# EAGLE design Robot Controller (EAGLE 6.4)
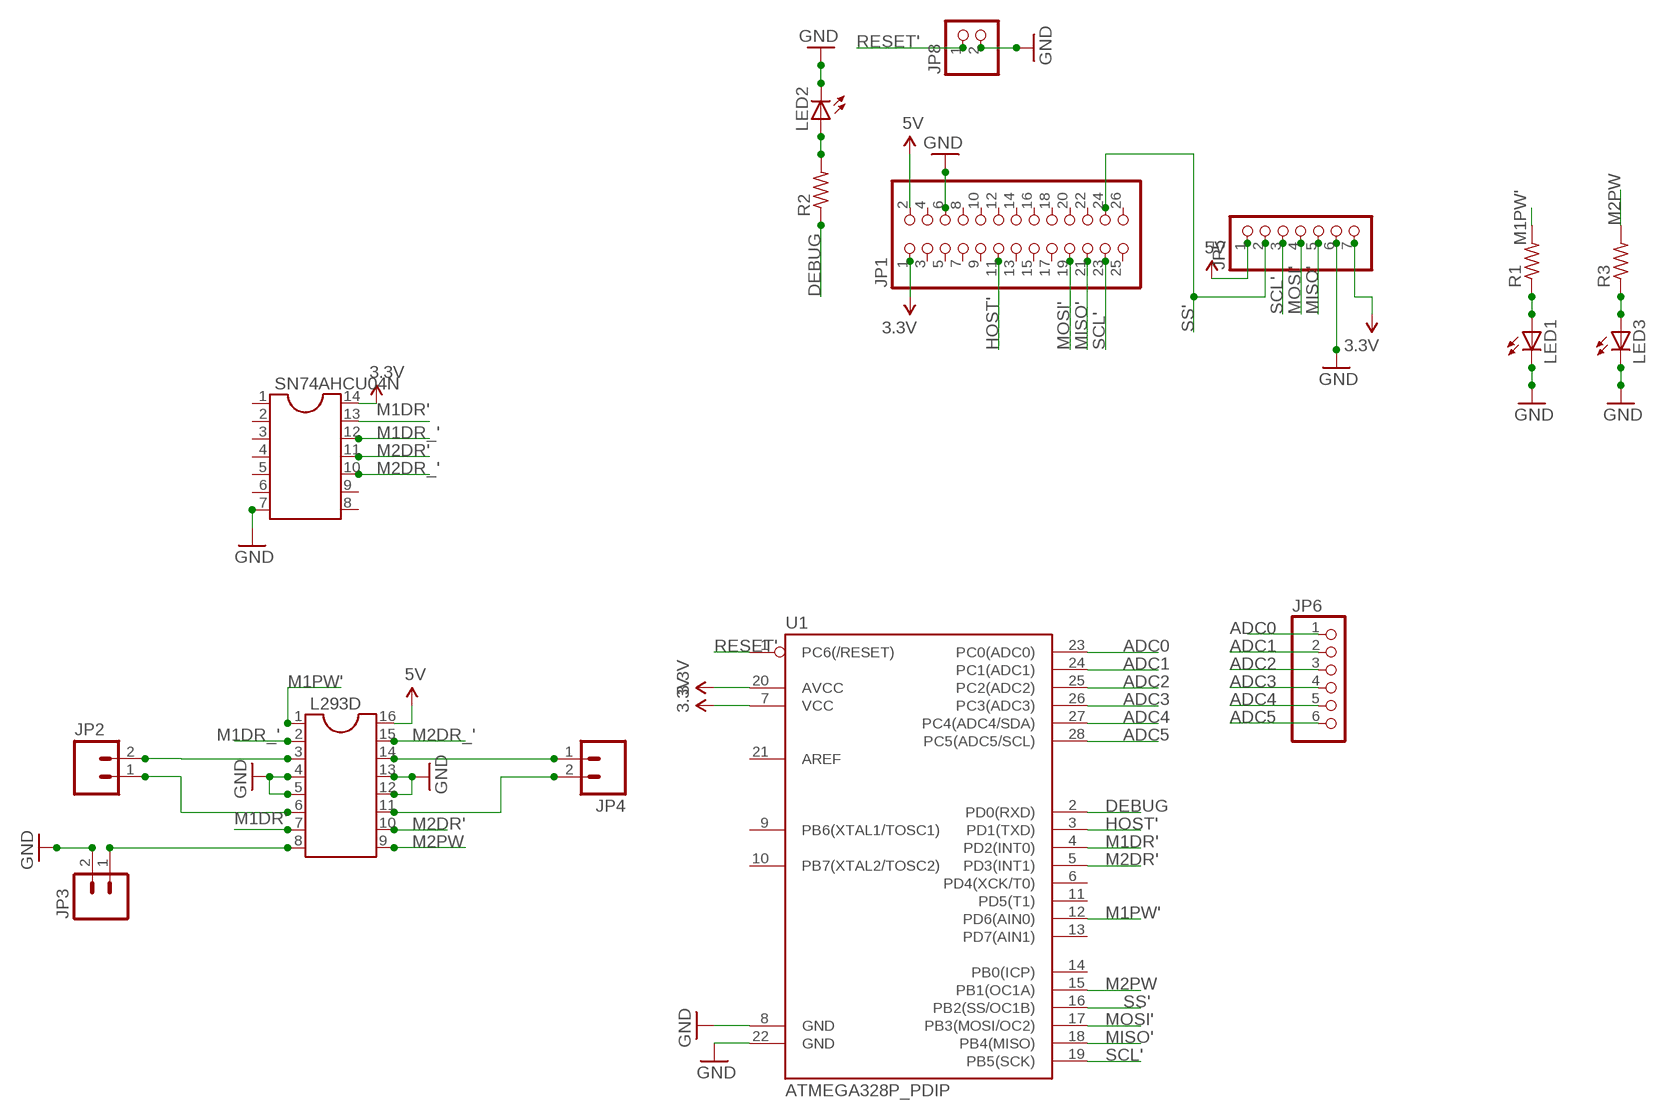
[diagram p0: schematic, sheet 1]

## Parts
JP1  PINHD-2X13  [2X13]
JP2  M025MM  [SCREWTERMINAL-5MM-2]
JP3  M025MM  [SCREWTERMINAL-5MM-2]
JP4  M025MM  [SCREWTERMINAL-5MM-2]
JP5  PINHD-1X7  [1X07]
JP6  PINHD-1X6  [1X06]
JP8  PINHD-1X2  [1X02]
L293D  DIL16S  [SOCKET-16]
LED1  LEDSMT1206  [1206]
LED2  LEDSMT1206  [1206]
LED3  LEDSMT1206  [1206]
R1  R-US_R3216  [R3216]
R2  R-US_R3216  [R3216]
R3  R-US_R3216  [R3216]
SN74AHCU04N  DIL14S  [SOCKET-14]
U1  ATMEGA328P_PDIP  [DIL28-3]

## Nets
3.3V: JP1.1 JP5.7 SN74AHCU04N.14 U1.7(VCC) U1.20(AVCC)
5V: JP1.2 JP5.1 L293D.16
ADC0: JP6.1 U1.23(PC0(ADC0))
ADC1: JP6.2 U1.24(PC1(ADC1))
ADC2: JP6.3 U1.25(PC2(ADC2))
ADC3: JP6.4 U1.26(PC3(ADC3))
ADC4: JP6.5 U1.27(PC4(ADC4/SDA))
ADC5: JP6.6 U1.28(PC5(ADC5/SCL))
DEBUG: R2.1 U1.2(PD0(RXD))
GND: JP1.6 JP3.2 JP5.6 JP8.2 L293D.4 L293D.5 L293D.12 L293D.13 LED1.C LED2.C LED3.C SN74AHCU04N.7 U1.8(GND) U1.22(GND)
HOST': JP1.11 U1.3(PD1(TXD))
M1DR': L293D.7 SN74AHCU04N.13 U1.4(PD2(INT0))
M1DR_': L293D.2 SN74AHCU04N.12
M1PW': L293D.1 R1.2 U1.12(PD6(AIN0))
M2DR': L293D.10 SN74AHCU04N.11 U1.5(PD3(INT1))
M2DR_': L293D.15 SN74AHCU04N.10
M2PW: L293D.9 R3.2 U1.15(PB1(OC1A))
MISO': JP1.21 JP5.5 U1.18(PB4(MISO))
MOSI': JP1.19 JP5.4 U1.17(PB3(MOSI/OC2))
N$3: LED1.A R1.1
N$8: JP2.2 L293D.3
N$9: JP2.1 L293D.6
N$10: JP3.1 L293D.8
N$14: LED3.A R3.1
N$17: LED2.A R2.2
N$18: JP4.1 L293D.14
N$19: JP4.2 L293D.11
RESET': JP8.1 U1.1(PC6(/RESET))
SCL': JP1.23 JP5.3 U1.19(PB5(SCK))
SS': JP1.24 JP5.2 U1.16(PB2(SS/OC1B))
Unconnected: JP1.3 JP1.4 JP1.5 JP1.7 JP1.8 JP1.9 JP1.10 JP1.12 JP1.13 JP1.14 JP1.15 JP1.16 JP1.17 JP1.18 JP1.20 JP1.22 JP1.25 JP1.26 SN74AHCU04N.1 SN74AHCU04N.2 SN74AHCU04N.3 SN74AHCU04N.4 SN74AHCU04N.5 SN74AHCU04N.6 SN74AHCU04N.8 SN74AHCU04N.9 U1.6(PD4(XCK/T0)) U1.9(PB6(XTAL1/TOSC1)) U1.10(PB7(XTAL2/TOSC2)) U1.11(PD5(T1)) U1.13(PD7(AIN1)) U1.14(PB0(ICP)) U1.21(AREF)

## Notes on the sheet
- RESET'
- M1PW'
- M2PW
- DEBUG
- SCL' | MOSI' | MISO'
- SS'
- HOST' | MOSI' | MISO' | SCL'
- M1DR'
- M1DR_'
- M2DR'
- M2DR_'
- ADC0
- RESET' | ADC0 | ADC1
- ADC1 | ADC2
- M1PW' | ADC2 | ADC3
- ADC3 | ADC4
- ADC4 | ADC5
- M1DR_' | M2DR_' | ADC5
- M1DR' | DEBUG
- M2DR' | HOST'
- M2PW | M1DR'
- M2DR'
- M1PW'
- M2PW
- SS'
- MOSI'
- MISO'
- SCL'

## Library data of the parts
JP1 = pinhead:PINHD-2X13: PIN HEADER
JP2-JP4 = SparkFun-Connectors:M02: Header 2 Standard 2-pin 0.1" header. Use with straight break away headers (SKU : PRT-00116), right angle break away headers (PRT-00553), swiss pins (PRT-00743), machine pins (PRT-00117), and female headers (PRT-00115). Molex polarized connector foot print use with SKU : PRT-08233 with associated crimp pins and housings.
JP5 = pinhead:PINHD-1X7: PIN HEADER
JP6 = pinhead:PINHD-1X6: PIN HEADER
JP8 = pinhead:PINHD-1X2: PIN HEADER
L293D = ic-package:DIL16: Dual In Line / Socket
LED1-LED3 = led:LED: LED OSRAM: - CHIPLED LG R971, LG N971, LY N971, LG Q971, LY Q971, LO R971, LY R971 LH N974, LH R974 LS Q976, LO Q976, LY Q976 LO Q996 - Hyper CHIPLED LW Q18S LB Q993, LB Q99A, LB R99A - SideLED LS A670, LO A670, LY A670, LG A670, LP A670 LB A673, LV A673, LT A673, LW A673 LH A674 LY A675 LS A676, LA A676, LO A676, LY A676, LW A676 LS A679, LY A679, LG A679 - Hyper Micro SIDELED® LS Y876, LA Y876, LO Y876, LY Y876 LT Y87S - SmartLED LW L88C, LW L88S LB L89C, LB L89S, LG L890 LS L89K, LO L89K, LY L89K LS L896, LA L896, LO L896, LY L896 - TOPLED LS T670, LO T670, LY T670, LG T670, LP T670 LSG T670, LSP T670, LSY T670, LOP T670, LYG T670 LG T671, LOG T671, LSG T671 LB T673, LV T673, LT T673, LW T673 LH T674 LS T676, LA T676, LO T676, LY T676, LB T676, LH T676, LSB T676, LW T676 LB T67C, LV T67C, LT T67C, LS T67K, LO T67K, LY T67K, LW E67C LS E67B, LA E67B, LO E67B, LY E67B, LB E67C, LV E67C, LT E67C LW T67C LS T679, LY T679, LG T679 LS T770, LO T770, LY T770, LG T770, LP T770 LB T773, LV T773, LT T773, LW T773 LH T774 LS E675, LA E675, LY E675, LS T675 LS T776, LA T776, LO T776, LY T776, LB T776 LHGB T686 LT T68C, LB T68C - Hyper Mini TOPLED® LB M676 - Mini TOPLED Santana® LG M470 LS M47K, LO M47K, LY M47K Source: http://www.osram.convergy.de LUXEON: - LUMILED® LXK2-PW12-R00, LXK2-PW12-S00, LXK2-PW14-U00, LXK2-PW14-V00 LXK2-PM12-R00, LXK2-PM12-S00, LXK2-PM14-U00 LXK2-PE12-Q00, LXK2-PE12-R00, LXK2-PE12-S00, LXK2-PE14-T00, LXK2-PE14-U00 LXK2-PB12-K00, LXK2-PB12-L00, LXK2-PB12-M00, LXK2-PB14-N00, LXK2-PB14-P00, LXK2-PB14-Q00 LXK2-PR12-L00, LXK2-PR12-M00, LXK2-PR14-Q00, LXK2-PR14-R00 LXK2-PD12-Q00, LXK2-PD12-R00, LXK2-PD12-S00 LXK2-PH12-R00, LXK2-PH12-S00 LXK2-PL12-P00, LXK2-PL12-Q00, LXK2-PL12-R00 Source: www.luxeon.com KINGBRIGHT: KA-3528ASYC Source: www.kingbright.com
R1-R3 = resistor:R-US_: RESISTOR, American symbol
SN74AHCU04N = ic-package:DIL14: Dual In Line / Socket
U1 = SparkFun-DigitalIC:ATMEGA328P_PDIP: uC used in the Arduino 32kb flash, 1k EEPROM, 2k SRAM This is the through-hole version of this chip.

## Board
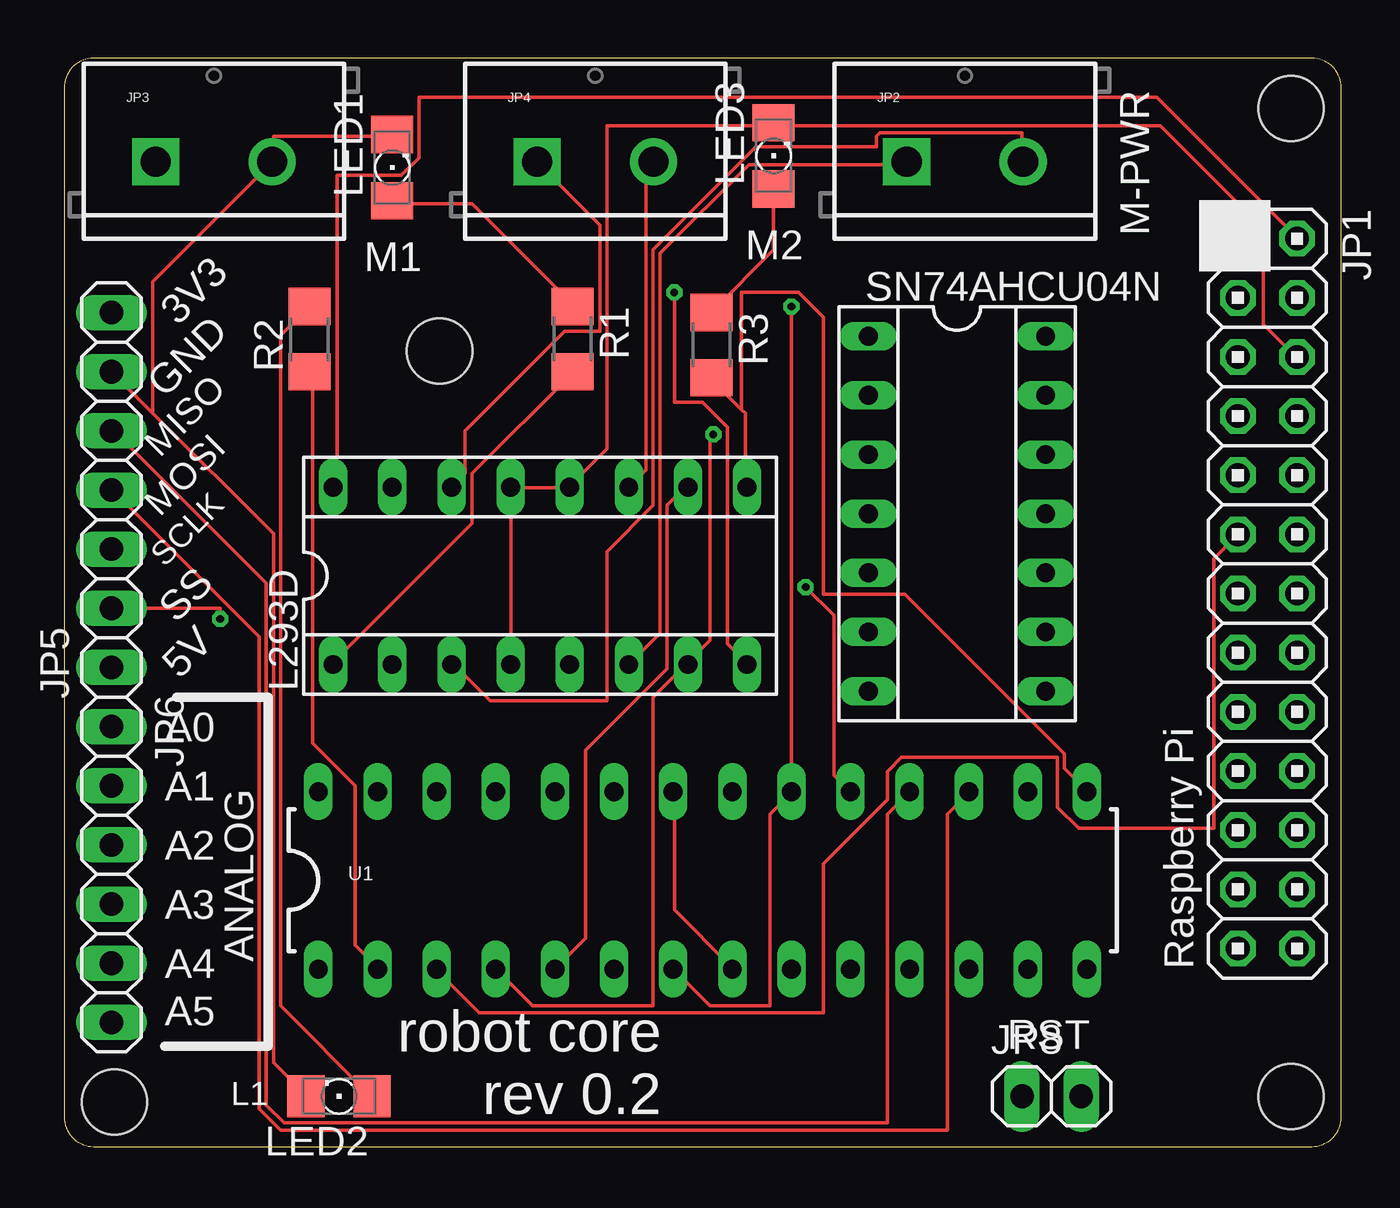
[diagram p1: board, top side]
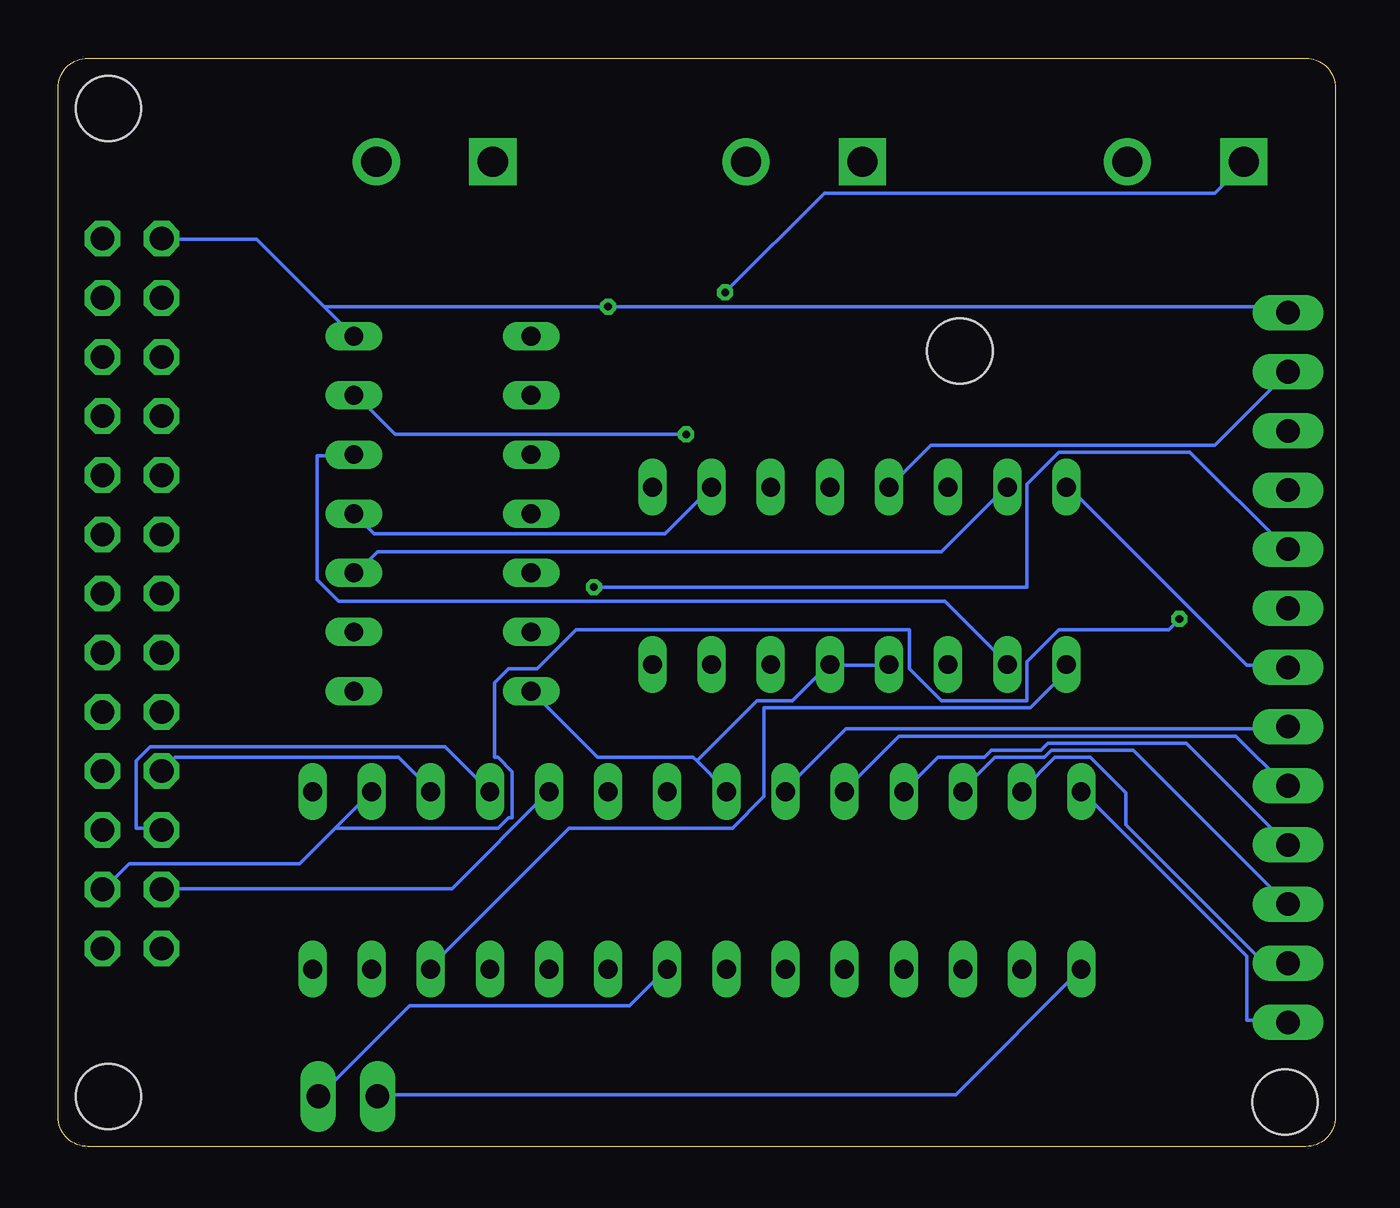
[diagram p2: board, bottom side, seen from below]

Size 54.86 x 46.74 mm. Coordinates in mm from the lower left corner, seen from the top.
Outline: 0,45.47 0,1.27 arc90 1.27,0 53.59,0 arc90 54.86,1.27 54.86,45.47 arc90 53.59,46.74 1.27,46.74 arc90 0,45.47
Copper layers (1*16): Top 0.0356mm / dielectric 1.5011mm / Bottom 0.0356mm
Design rules "OSHPark": minimum track width 6mil, minimum drill 13mil, track to track 6mil, track to pad 6mil, pad to pad 6mil, via to via 6mil, smd to smd 6mil, copper to edge 15mil, drill to drill 6mil, minimum pad ring 7mil, minimum via ring 7mil, stop-mask expansion 4mil, vias tented up to drill 0mil, thermal gap 10mil
Holes 2.8 mm at 52.71,2.16 52.71,44.58 16.13,34.16 2.16,1.91

### Footprints (pad centres in the part's own frame; a part is rotated, then mirrored left to right if it is on the bottom)
2X13 = drill 1.016 octagon: 1 -15.24,-1.27; 2 -15.24,1.27; 3 -12.7,-1.27; 4 -12.7,1.27; 5 -10.16,-1.27; 6 -10.16,1.27; 7 -7.62,-1.27; 8 -7.62,1.27; 9 -5.08,-1.27; 10 -5.08,1.27; 11 -2.54,-1.27; 12 -2.54,1.27; 13 0,-1.27; 14 0,1.27; 15 2.54,-1.27; 16 2.54,1.27; 17 5.08,-1.27; 18 5.08,1.27; 19 7.62,-1.27; 20 7.62,1.27; 21 10.16,-1.27; 22 10.16,1.27; 23 12.7,-1.27; 24 12.7,1.27; 25 15.24,-1.27; 26 15.24,1.27
SCREWTERMINAL-5MM-2 = drill 1.3 pad 2.032 square: 1 0,0 | drill 1.3 pad 2.032: 2 5,0
1X07 = drill 1.016 long: 1 -7.62,0; 2 -5.08,0; 3 -2.54,0; 4 0,0; 5 2.54,0; 6 5.08,0; 7 7.62,0
1X06 = drill 1.016 long: 1 -6.35,0; 2 -3.81,0; 3 -1.27,0; 4 1.27,0; 5 3.81,0; 6 6.35,0
1X02 = drill 1.016 long: 1 -1.27,0; 2 1.27,0
SOCKET-16 = drill 0.813 long: 1 -8.89,-3.81; 2 -6.35,-3.81; 3 -3.81,-3.81; 4 -1.27,-3.81; 5 1.27,-3.81; 6 3.81,-3.81; 7 6.35,-3.81; 8 8.89,-3.81; 9 8.89,3.81; 10 6.35,3.81; 11 3.81,3.81; 12 1.27,3.81; 13 -1.27,3.81; 14 -3.81,3.81; 15 -6.35,3.81; 16 -8.89,3.81
1206 = smd 1.6 x 1.803: A -1.422,0; C 1.422,0
R3216 = smd 1.6 x 1.8: 1 -1.4,0; 2 1.4,0
SOCKET-14 = drill 0.813 long: 1 -7.62,-3.81; 2 -5.08,-3.81; 3 -2.54,-3.81; 4 0,-3.81; 5 2.54,-3.81; 6 5.08,-3.81; 7 7.62,-3.81; 8 7.62,3.81; 9 5.08,3.81; 10 2.54,3.81; 11 0,3.81; 12 -2.54,3.81; 13 -5.08,3.81; 14 -7.62,3.81
DIL28-3 = drill 0.813 long: 1 -16.51,-3.81; 2 -13.97,-3.81; 3 -11.43,-3.81; 4 -8.89,-3.81; 5 -6.35,-3.81; 6 -3.81,-3.81; 7 -1.27,-3.81; 8 1.27,-3.81; 9 3.81,-3.81; 10 6.35,-3.81; 11 8.89,-3.81; 12 11.43,-3.81; 13 13.97,-3.81; 14 16.51,-3.81; 15 16.51,3.81; 16 13.97,3.81; 17 11.43,3.81; 18 8.89,3.81; 19 6.35,3.81; 20 3.81,3.81; 21 1.27,3.81; 22 -1.27,3.81; 23 -3.81,3.81; 24 -6.35,3.81; 25 -8.89,3.81; 26 -11.43,3.81; 27 -13.97,3.81; 28 -16.51,3.81

### Placement (x,y rotation side)
JP1  51.69,23.75 270 top
JP2  36.2,42.29 0 top
JP3  3.94,42.29 0 top
JP4  20.32,42.29 0 top
JP5  2.03,28.19 90 top
JP6  2.03,11.68 270 top
JP8  42.42,2.16 0 top
L293D  20.45,24.51 0 top
LED1  14.1,42.04 90 top
LED2  11.81,2.16 180 top
LED3  30.48,42.55 90 top
R1  21.84,34.67 270 top
R2  10.54,34.67 90 top
R3  27.81,34.42 270 top
SN74AHCU04N  38.35,27.18 270 top
U1  27.43,11.43 0 top

### Tracks (layer width: path | path; a pad name or v marks a point on that pad's centre or on a via)
3.3V  (via drill 0.33)
  Top 0.152: U1.7 26.21,7.57 27.74,6.04 30.33,6.04 30.33,14.28 31.24,15.19 U1.20 31.24,15.34 v31.24,36.07
  Bottom 0.152: 43.43,36.07 46.33,38.96 50.29,38.96 JP1.1 | 43.43,36.07 42.21,34.85 SN74AHCU04N.14 | 43.43,36.07 v31.24,36.07 2.29,36.07 2.13,35.92 JP5.7
5V
  Top 0.152: JP1.2 52.88,39.12 46.94,45.06 15.24,45.06 15.24,42.47 14.48,41.71 11.73,41.71 11.73,28.6 11.58,28.45 L293D.16
  Bottom 0.152: L293D.16 11.43,28.3 3.81,20.68 2.13,20.68 JP5.1
ADC0
  Bottom 0.152: U1.23 23.62,15.34 21.03,17.93 2.13,17.93 JP6.1
ADC1
  Bottom 0.152: U1.24 21.03,15.34 18.74,17.63 4.27,17.63 2.13,15.49 JP6.2
ADC2
  Bottom 0.152: U1.25 18.44,15.34 17.07,16.71 15.09,16.71 14.78,17.02 12.65,17.02 12.34,17.32 6.4,17.32 2.13,13.06 JP6.3
ADC3
  Bottom 0.152: U1.26 16,15.34 14.63,16.71 12.5,16.71 12.19,17.02 8.69,17.02 2.13,10.46 JP6.4
ADC4
  Bottom 0.152: U1.27 13.41,15.34 12.04,16.71 10.52,16.71 8.99,15.19 8.99,13.82 3.05,7.87 2.13,7.87 JP6.5
ADC5
  Bottom 0.152: U1.28 10.82,15.19 3.81,8.18 3.81,5.44 2.13,5.44 JP6.6
DEBUG
  Top 0.152: R2.1 10.67,33.17 10.67,17.32 12.5,15.49 12.5,8.64 13.41,7.72 U1.2
GND
  Top 0.152: LED1.C 14.02,43.38 8.99,43.38 8.99,42.32 JP3.2 8.84,42.16 3.81,37.14 3.81,31.5 | 3.81,31.5 2.13,33.17 JP5.6 | 3.81,31.5 8.99,26.31 8.99,3.61 10.36,2.23 LED2.C | U1.8 28.65,7.72 26.21,10.16 26.21,15.19 U1.22 | 30.48,43.84 23.32,43.84 23.32,29.97 21.79,28.45 L293D.12 21.64,28.3 19.2,28.3 | 30.48,43.84 LED3.C 30.48,43.84 | 19.2,28.3 L293D.13 19.2,28.3 | 30.48,43.84 47.09,43.84 51.51,39.42 51.51,35.31 52.88,33.93 JP1.6 | 19.2,28.3 19.2,20.83 L293D.4
  Bottom 0.152: 27.43,16.56 26.21,15.34 U1.22 | 27.43,16.56 27.58,16.71 31.7,16.71 34.44,19.46 SN74AHCU04N.7 | JP8.2 43.59,2.23 39.78,6.04 30.33,6.04 28.8,7.57 U1.8 | L293D.4 19.2,20.68 21.64,20.68 L293D.5 21.79,20.68 23.32,19.15 24.84,19.15 27.43,16.56 | JP5.6 2.13,33.17 5.18,30.12 17.37,30.12 19.05,28.45 L293D.13
HOST'
  Top 0.152: U1.3 16,7.57 17.83,5.74 32.61,5.74 32.61,12.14 35.36,14.88 35.36,16.1 35.97,16.71 42.67,16.71 42.67,14.58 43.59,13.67 49.38,13.67 49.38,25.25 50.29,26.16 JP1.11
M1DR'  (via drill 0.33)
  Top 0.152: U1.4 18.59,7.57 20.12,6.04 25.3,6.04 25.3,19.3 26.67,20.68 L293D.7 26.82,20.83 27.74,21.74 27.74,30.43 v27.89,30.58
  Bottom 0.152: v27.89,30.58 40.39,30.58 42.06,32.26 SN74AHCU04N.13
M1DR_'
  Bottom 0.152: L293D.2 14.17,20.83 16.76,23.42 42.82,23.42 43.74,24.33 43.74,29.67 42.21,29.67 SN74AHCU04N.12
M1PW'
  Top 0.152: R1.2 21.79,33.17 17.53,28.9 17.53,26.77 11.58,20.83 L293D.1
  Bottom 0.152: U1.12 38.86,7.72 32.92,13.67 25.91,13.67 24.54,15.04 24.54,18.85 13.11,18.85 11.58,20.37 11.58,20.68 L293D.1
M2DR'
  Top 0.152: U1.5 21.18,7.72 22.4,8.94 22.4,17.02 25.91,20.52 25.91,27.53 26.67,28.3 L293D.10
  Bottom 0.152: SN74AHCU04N.11 42.06,27.08 41.3,26.31 28.8,26.31 26.82,28.3 L293D.10
M2DR_'
  Bottom 0.152: L293D.15 14.17,28.3 16.92,25.55 41.15,25.55 42.06,24.64 SN74AHCU04N.10
M2PW
  Top 0.152: 29.11,31.65 29.26,31.5 29.26,28.45 L293D.9 | 29.11,31.65 27.89,32.87 R3.2 | 29.11,31.65 29.11,36.68 31.55,36.68 32.61,35.61 32.61,23.72 36.12,23.72 42.98,16.87 42.98,16.26 43.89,15.34 U1.15
MISO'
  Top 0.152: JP5.5 2.13,30.73 8.69,24.18 8.69,1.78 9.45,1.02 35.36,1.02 35.36,14.28 36.27,15.19 U1.18
  Bottom 0.152: U1.18 36.42,15.34 38.25,17.17 50.9,17.17 51.51,16.56 51.51,13.67 50.44,13.67 JP1.21
MOSI'
  Top 0.152: JP5.4 2.13,28.14 8.38,21.89 8.38,1.63 9.3,0.71 37.95,0.71 37.95,14.28 38.86,15.19 U1.17
  Bottom 0.152: U1.17 38.86,15.34 40.23,16.71 49.84,16.71 50.29,16.26 JP1.19
N$3
  Top 0.152: R1.1 21.79,36.22 17.53,40.49 14.17,40.49 LED1.A
N$8
  Top 0.152: L293D.3 16.76,20.68 18.29,19.15 23.32,19.15 23.32,25.55 25.3,27.53 25.3,38.51 29.72,42.93 34.9,42.93 34.9,43.38 35.05,43.54 41.15,43.54 41.15,42.32 JP2.2
N$9
  Top 0.152: L293D.6 24.38,20.83 25.6,22.05 25.6,38.35 29.41,42.16 36.12,42.16 JP2.1
N$10  (via drill 0.33)
  Top 0.152: v26.21,36.68 26.21,31.95 27.43,31.95 28.5,30.89 28.5,21.59 29.26,20.83 L293D.8
  Bottom 0.152: v26.21,36.68 21.95,40.95 5.18,40.95 3.96,42.16 JP3.1
N$14
  Top 0.152: R3.1 27.89,35.92 30.48,38.51 30.48,41.1 LED3.A
N$17
  Top 0.152: R2.2 10.52,36.07 9.3,34.85 9.3,6.04 13.11,2.23 LED2.A
N$18
  Top 0.152: L293D.14 16.76,28.45 17.22,28.9 17.22,30.73 21.49,35 23.01,35 23.01,39.57 20.42,42.16 JP4.1
N$19
  Top 0.152: L293D.11 24.38,28.45 24.99,29.06 24.99,41.86 25.3,42.16 JP4.2
RESET'
  Bottom 0.152: U1.1 10.97,7.57 16.31,2.23 41.15,2.23 JP8.1
SCL'  (via drill 0.33)
  Top 0.152: v31.85,24.03 33.07,22.81 33.07,15.95 33.68,15.34 U1.19
  Bottom 0.152: U1.19 33.83,15.19 37.95,11.07 50.29,11.07 JP1.23 | v31.85,24.03 13.26,24.03 13.26,28.45 11.89,29.82 6.25,29.82 2.13,25.71 JP5.3
SS'  (via drill 0.33)
  Top 0.152: v6.71,22.66 6.71,23.11 2.13,23.11 JP5.2
  Bottom 0.152: 42.98,13.67 44.5,12.14 51.82,12.14 52.88,11.07 JP1.24 | 42.98,13.67 41.45,15.19 U1.16 | v6.71,22.66 7.16,22.2 11.89,22.2 13.26,20.83 13.26,19.15 16.92,19.15 18.29,20.52 18.29,22.2 32.61,22.2 34.29,20.52 35.51,20.52 36.12,19.91 36.12,16.71 35.97,16.71 35.36,16.1 35.36,14.12 35.51,14.12 35.97,13.67 42.98,13.67

### Text on the board
tPlace: M2 | M-PWR | 3V3 | M1 | GND | MISO | MOSI | SCLK | SS | 5V | A0 | ANALOG | A1 | A2 | A3 | A4 | Raspberry Pi | A5 | robot core / rev 0.2 | RST | L1